# Altium schematic sheet Control.SchDoc
size 180 x 90 mm; SheetNumber: 1; SheetTotal: 1; ENG_APP_DATE: --/--/--; DSN_APP_DATE: --/--/--; CHK_APP_DATE: --/--/--
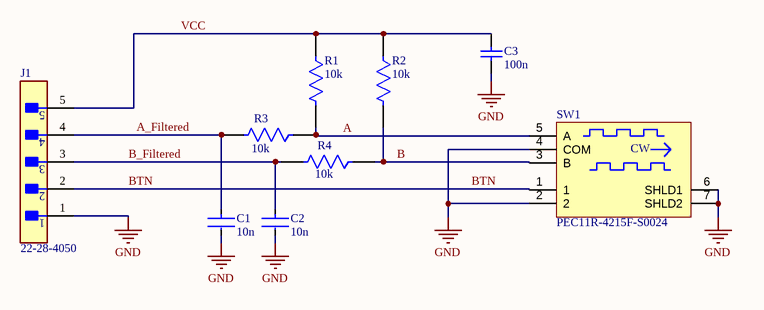
[diagram p0: Control.SchDoc]

## Parts
C1  10n  [FP-CL31-IPC_C]
C2  10n  [FP-CL31-IPC_C]
C3  100n  [CAPC1206(3216)100_N]
J1  22-28-4050  [FP-22-28-4050-MFG]
R1  10k  [FP-CRCW1206-e3-IPC_A]
R2  10k  [FP-CRCW1206-e3-IPC_A]
R3  10k  [FP-CRCW1206-e3-IPC_A]
R4  10k  [FP-CRCW1206-e3-IPC_A]
SW1  PEC11R-4215F-S0024  [BOUR-PEC11R-4XXXF-SXXXX_V]

## Nets
GND: C1.2 C2.2 C3.1 J1.1 SW1.2 SW1.4(COM) SW1.6(SHLD1) SW1.7(SHLD2)
A: R1.2 R3.1 SW1.5(A)
A_Filtered: C1.1 J1.4 R3.2
B: R2.2 R4.1 SW1.3(B)
B_Filtered: C2.1 J1.3 R4.2
BTN: J1.2 SW1.1
VCC: C3.2 J1.5 R1.1 R2.1

## Notes on the sheet
- THIS DOCUMENT AND THE DATA DISCLOSED HEREIN OR
- HEREWITH IS THE PROPERTY OF ALTIUM LIMITED AND MAY
- DWG NO:
- REVISION
- REV:
- DESCRIPTION
- DATE
- APPROVED
- BE FREELY DISTRIBUTED IN WHOLE. NO RIGHTS ARE
- RESERVED OR EXPRESS OR IMPLIED WARANTEE GIVEN.
- ENG:
- APPROVALS
- PROJECT
- DSN:
- CHK:
- REFERENCE DOCUMENTS
- PROJECT REVISION:
- TITLE
- DOCUMENT REVISION:
- DESIGN ITEM:
- BOM:
- FAB DWG:
- PCB DWG:
- ASSY DWG:
- SCALE:
- A3
- SIZE
- CAGE CODE
- FILE NAME
- DWG NO.
- SHEET
- OF
- REV
- (in symbol CMP-011-00007-2) CW

## Library data of the parts
C1 C2 = CMP-13271-002682-1: Cap Ceramic 10nF 100V X7R ±5% SMD 1206 +125°C Embossed T/R; Manufacturer Part Number 1: CL31B103JCCNNWC; Case Code (Imperial): 1206; Case Code (Metric): 3216; Packaging: Tape and Reel; Tolerance: 5%; Length: 0.126inch; Case/Package: 1206; Thickness: 0.037inch; Voltage Rating: 100V; Mount: Surface Mount; Min Operating Temperature: -55°C; Capacitance: 10nF; Max Operating Temperature: 125°C; Width: 0.063inch; Package Quantity: 1
C3 = CMP-1037-04190-1: CAP 100nF 25V ±5% 1206 (3216 Metric) Thickness 1mm SMD; Case-EIA: 1206; Tolerance: Â±5%; Case-Metric: 3216; Value: 100nF; Rated Voltage: 25 V; Technology: SMT; Max Thickness: 1 mm
J1 = CMP-00257-00278173-1: 22-28-4050 KK® 254 Breakaway Header, Vertical, 5 Circuits, Tin (Sn) Plating, Mating Pin Length 6.09mm; NexarPartId: 278173; Voltage Rating: 250V; Number of Contacts: 5; Contact Resistance: 20mΩ; Gender: Male; Pitch: 2.54mm; Connector Type: Male Pin; Current Rating: 4A; Glow Wire Compliant: Non-compliant; Max Voltage Rating (DC): 250.25kV; Flammability Rating: UL94 V-0; Min Operating Temperature: 0°C; REACH SVHC: Unknown; Lead Free: Lead Free; Termination: Solder; RoHS: Compliant; Schedule B: 8536694040; Number of Circuits: 5; Mount: Through Hole; Lead Pitch: 2.54mm; Height: 2.29mm; Voltage Rating (DC): 250V; Max Operating Temperature: 75°C; Width: 2.49mm; Radiation Hardening: No; Contact Plating: Tin; Orientation: Vertical; Length: 12.7mm; Number of Rows: 1; Housing Material: Thermoplastic; Contact Material: Brass; Packaging: Bulk; Contact Mating Length: 6.096mm; Housing Color: Black; Color: Black; Number of Positions: 5
R1-R4 = CMP-2003-04807-2: RES Thick Film, 10kΩ, 1%, 0.25W, 100ppm/°C, 1206; Working Voltage: 200V; Max Power Dissipation: 250mW; Resistance: 10kR; Tolerance: 1%; Width: 0.063inch; Height: 0.55mm; Number of Pins: 2; Voltage Rating: 200V; Temperature Coefficient: 100ppm/°C; Military Standard: Not; Features: Automotive AEC-Q200; Depth: 1.6mm; Radiation Hardening: No; Termination: SMD/SMT; Case Code (Imperial): 1206; Weight: 0.000353oz; Length: 3.2mm; Package Quantity: 10; Voltage Rating (DC): 200V; Case/Package: 1206; Min Operating Temperature: -55°C; Number of Terminations: 2; Composition: Thick Film; Contact Plating: Tin; Power Rating: 250mW; Packaging: Tape and Reel; Max Operating Temperature: 155°C; Lead Free: Lead Free; Case Code (Metric): 3216
SW1 = CMP-011-00007-2: 12 mm Incremental Encoder, 24 Detent, -30 to 70 degC, 5-Pin THD, RoHS, Bulk; Manufacturer: Bourns; Channels: 2; RoHS Compliant: True; Product Type: Mechanical; Datasheet Version: Jul-14; Package Quantity: 150; Manufacturer URL: http://www.bourns.com/; Case/Package: PEC11R-4XXXF-SXXXX; Packaging: Bulk; Package Reference: PEC11R-4XXXF-SXXXX; Min Operating Temperature: -30°C; Max Operating Temperature: 70°C; Datasheet URL: http://www.bourns.com/docs/Product-Datasheets/PEC11R.pdf; Mounting Technology: TH; Package Description: 5-Pin Through Hole Device, Body 12.5 x 13.4 mm